# Altium schematic sheet ESP32_T&H_Interface.SchDoc
size A; SheetNumber: 3; SheetTotal: 3
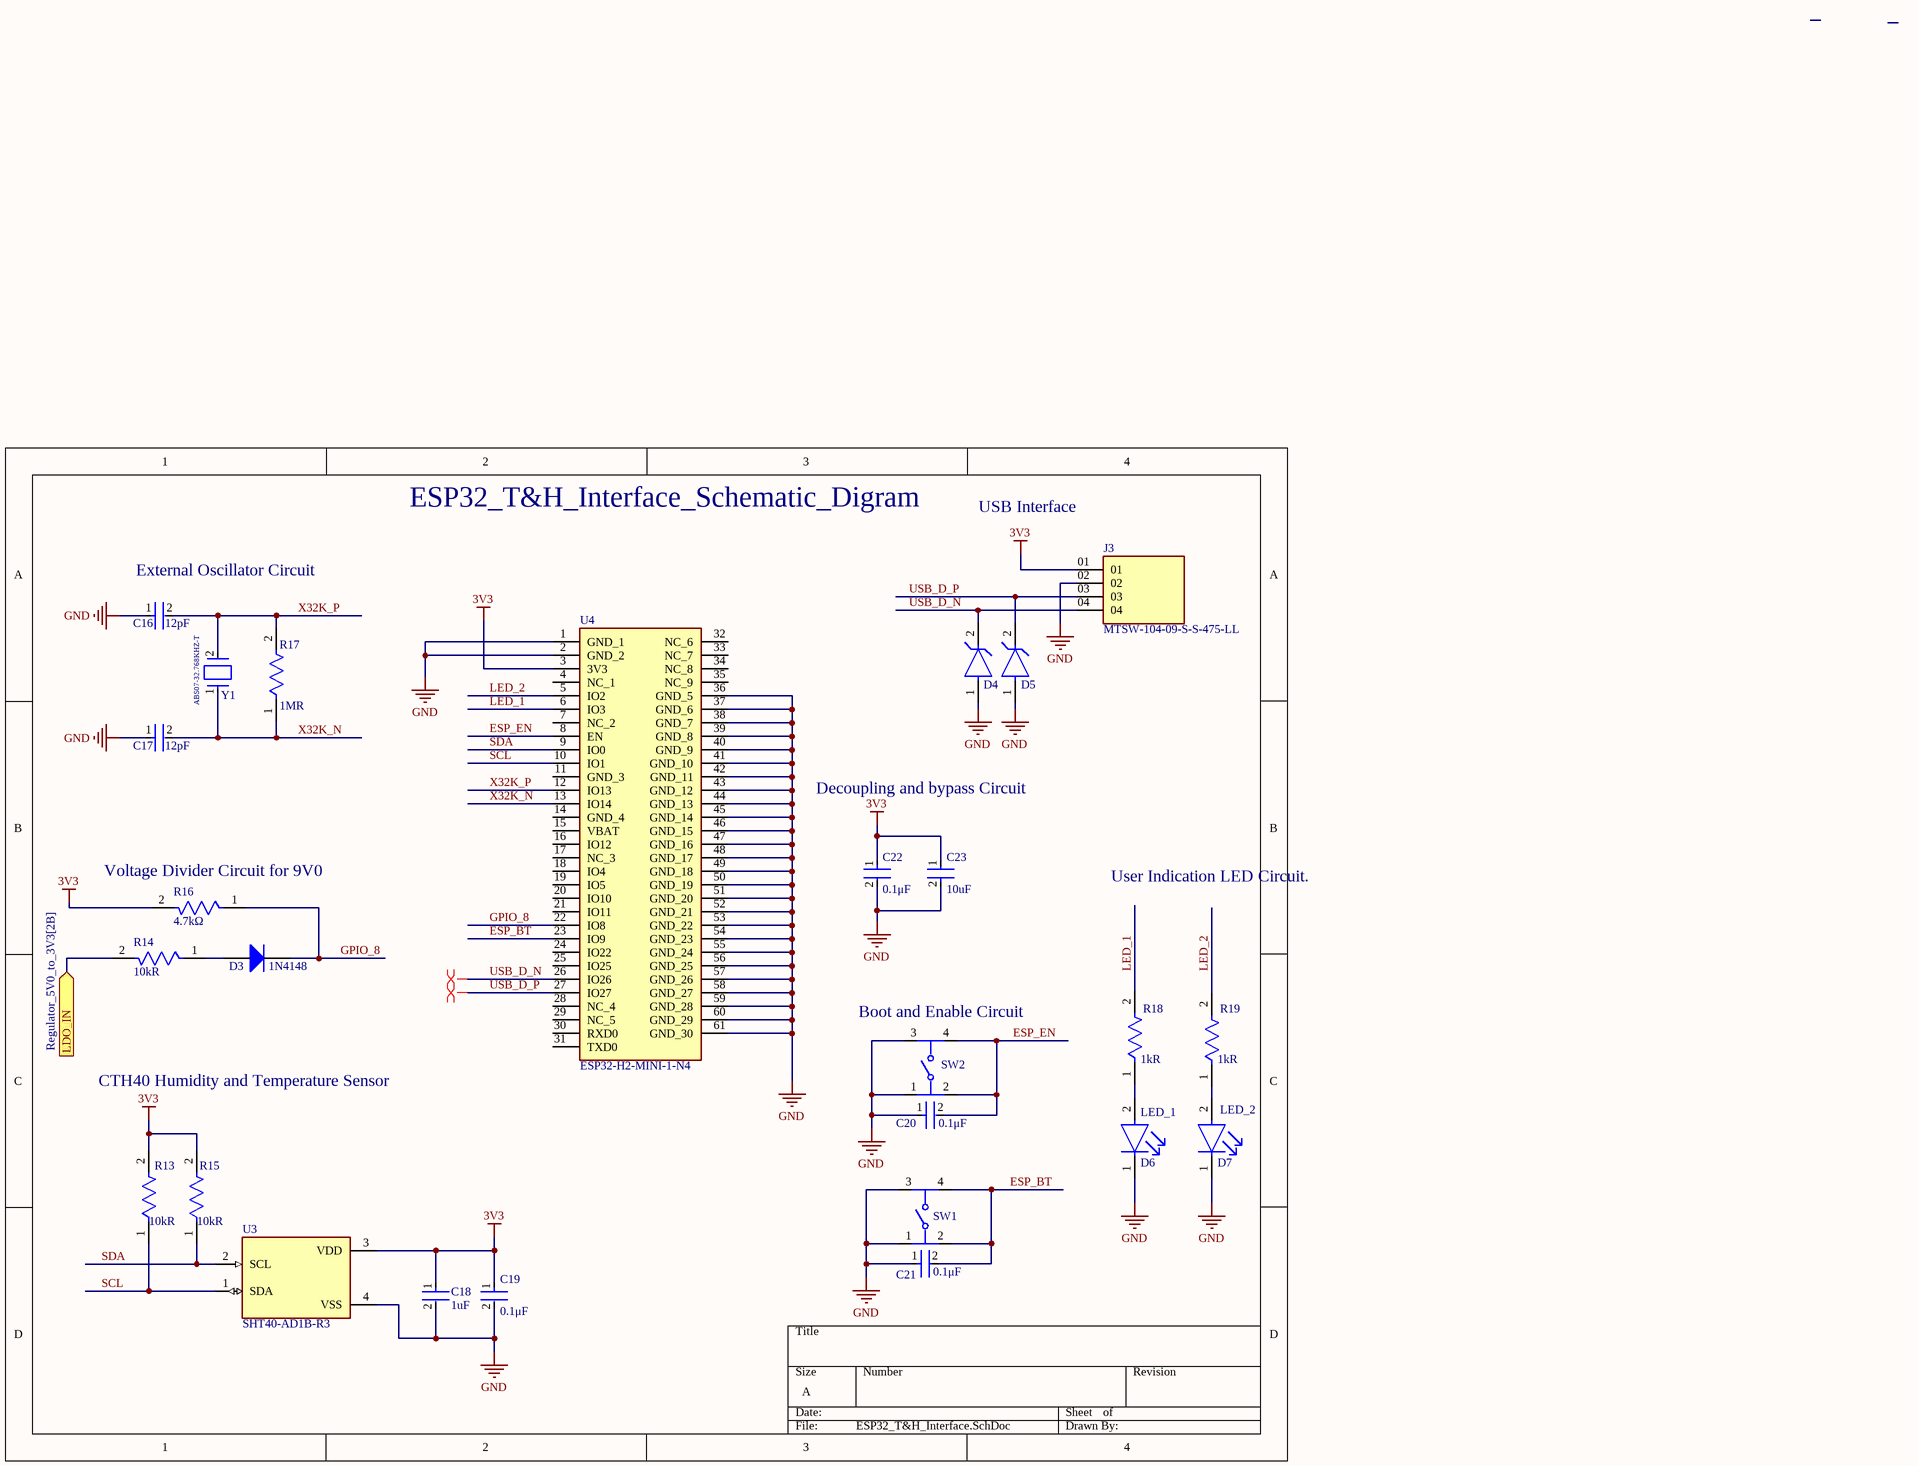
[diagram p0: ESP32_T&H_Interface.SchDoc]

## Parts
C16  Capacitance: 12pF  [FP-0402-L_1_0_1-W_0_5_0_1-IPC_B]  (hidden comment: 04025A120JAT2A)
C17  Capacitance: 12pF  [FP-0402-L_1_0_1-W_0_5_0_1-IPC_B]  (hidden comment: 04025A120JAT2A)
C18  Capacitance: 1uF  [FP-GRM15-0_1-MFG]  (hidden comment: GRM155R61A105KE15D)
C19  Capacitance: 0.1μF  [FP-C0603C-CF-MFG]  (hidden comment: C0603C104K8RACTU)
C20  Capacitance: 0.1μF  [FP-C0603C-CF-MFG]  (hidden comment: C0603C104K8RACTU)
C21  Capacitance: 0.1μF  [FP-C0603C-CF-MFG]  (hidden comment: C0603C104K8RACTU)
C22  Capacitance: 0.1μF  [FP-C0603C-CF-MFG]  (hidden comment: C0603C104K8RACTU)
C23  Capacitance: 10uF  [FP-C1608-080-0_1-IPC_A]  (hidden comment: C1608X5R1A106M080AC)
D3  1N4148  [DIOD-SOD323-2-A_V]
D4  UCLAMP3601P.TNT  [FP-SLP1006P2-MFG]  (value not drawn)
D5  UCLAMP3601P.TNT  [FP-SLP1006P2-MFG]  (value not drawn)
D6  APHHS1005CGCK  [FP-APHHS1005CGCK-MFG]  (value not drawn)
D7  APHHS1005CGCK  [FP-APHHS1005CGCK-MFG]  (value not drawn)
J3  MTSW-104-09-S-S-475-LL  [SAMTEC_MTSW-104-09-S-S-475-LL]
R13  Resistance: 10kR  [FP-AC0402-MFG]  (hidden comment: AC0402FR-0710KL)
R14  Resistance: 10kR  [FP-AC0402-MFG]  (hidden comment: AC0402FR-0710KL)
R15  Resistance: 10kR  [FP-AC0402-MFG]  (hidden comment: AC0402FR-0710KL)
R16  Resistance: 4.7kΩ  [FP-RC0402-0_4-MFG]  (hidden comment: RC0402JR-074K7L)
R17  Resistance: 1MR  [FP-MCR01-IPC_B]  (hidden comment: MCR01MRTF1004)
R18  Resistance: 1kR  [FP-RMCF0402-MFG]  (hidden comment: RMCF0402FT1K00)
R19  Resistance: 1kR  [FP-RMCF0402-MFG]  (hidden comment: RMCF0402FT1K00)
SW1  KMR221NGLFS  [FP-KMR221NGLFS-0]  (value not drawn)
SW2  KMR221NGLFS  [FP-KMR221NGLFS-0]  (value not drawn)
U3  SHT40-AD1B-R3  [SHT4X]
U4  ESP32-H2-MINI-1-N4  [ESP32H2MINI1N4]
Y1  ABS07-32.768KHZ-T  [FP-ABS07-MFG]

## Ports
LDO_IN (in, see Regulator_5V0_to_3V3[2B])

## Nets
3V3: C18.1 C19.1 C22.1 C23.1 J3.01 R13.2 R15.2 R16.2 U3.3(VDD) U4.3(3V3)
GND: C16.1 C17.1 C18.2 C19.2 C20.1 C21.1 C22.2 C23.2 D4.1(A) D5.1(A) D6.1(C) D7.1(C) J3.02 SW1.1 SW1.3 SW2.1 SW2.3 U3.4(VSS) U4.1(GND_1) U4.2(GND_2) U4.36(GND_5) U4.37(GND_6) U4.38(GND_7) U4.39(GND_8) U4.40(GND_9) U4.41(GND_10) U4.42(GND_11) U4.43(GND_12) U4.44(GND_13) U4.45(GND_14) U4.46(GND_15) U4.47(GND_16) U4.48(GND_17) U4.49(GND_18) U4.50(GND_19) U4.51(GND_20) U4.52(GND_21) U4.53(GND_22) U4.54(GND_23) U4.55(GND_24) U4.56(GND_25) U4.57(GND_26) U4.58(GND_27) U4.59(GND_28) U4.60(GND_29) U4.61(GND_30)
ESP_BT: C21.2 SW1.2 SW1.4 U4.23(IO9)
ESP_EN: C20.2 SW2.2 SW2.4 U4.8(EN)
GPIO_8: D3.2(K) R16.1 U4.22(IO8)
LDO_IN: R14.2 ; port LDO_IN
LED_1: R18.2 U4.6(IO3)
LED_2: R19.2 U4.5(IO2)
SCL: R13.1 U3.1(SDA) U4.10(IO1)
SDA: R15.1 U3.2(SCL) U4.9(IO0)
USB_D_N: D4.2(C) J3.04 U4.26(IO26)
USB_D_P: D5.2(C) J3.03 U4.27(IO27)
X32K_N: C17.2 R17.1 U4.13(IO14) Y1.1
X32K_P: C16.2 R17.2 U4.12(IO13) Y1.2
NetD3_1: D3.1(A) R14.1
NetD6_2: D6.2(A) R18.1
NetD7_2: D7.2(A) R19.1

Not connected (* = marked no-connect by the designer): U4 4(NC_1) 7(NC_2) 11(GND_3) 14(GND_4) 15(VBAT) 16(IO12) 17(NC_3) 18(IO4) 19(IO5) 20(IO10) 21(IO11) 24(IO22) 25(IO25) 28(NC_4) 29(NC_5) 30(RXD0) 31(TXD0) 32(NC_6) 33(NC_7) 34(NC_8) 35(NC_9)

## Layout directives
differential pair: USB_D_N, USB_D_P

## Notes on the sheet
- ESP32_T&H_Interface_Schematic_Digram
- USB Interface
- (near C16) External Oscillator Circuit
- Decoupling and bypass Circuit
- (near R16) Voltage Divider Circuit for 9V0
- User Indication LED Circuit.
- (near SW2) Boot and Enable Circuit
- CTH40 Humidity and Temperature Sensor
- (near D6) LED_1
- (near D7) LED_2

## Library data of the parts
C16 C17 = CMP-2008-02574-2: General Purpose Ceramic Capacitor, 0402, 12pF, 5%, C0G, 30ppm/°C, 50V; Insulation Resistance: 100GR; Radiation Hardening: No; RoHS Compliant: Yes; Voltage Rating: 50V; Case Code (Imperial): 0402; Height: 0.5mm; Voltage: 50V; Voltage Rating (DC): 50V; Mount: Surface Mount; Thickness: 0.022inch; Depth: 0.5mm; Max Operating Temperature: 125°C; Construction: Flat; Termination: SMD/SMT; Tolerance: 5%; Length: 1mm; Lead Free: Lead Free; Dielectric: C0G; Number of Pins: 2; Package Quantity: 1; Series: -; Temperature Coefficient: 30ppm/°C; Min Operating Temperature: -55°C; Case/Package: 0402; Packaging: Tape and Reel; Case Code (Metric): 1005; Width: 0.02inch; REACH SVHC: No SVHC
C18 = CMP-2008-04556-2: CAP CER 1UF 10V X5R 0402; Manufacturer: Murata; Material: Ceramic; Tolerance: 10%; Temperature Coefficient: 15%; Octopart: https://octopart.com/grm155r61a105ke15d-murata-197442; Manufacturer Part Number: GRM155R61A105KE15D; Lead Free: Yes; ComponentLink2Description: Datasheet; Temperature: -55°C to +85°C; Temperature Range High: +85°C; Height: 0.55mm; Ipc Land Pattern Name: CAPC10050X50; ComponentLink2URL: https://search.murata.co.jp/Ceramy/image/img/A01X/G101/ENG/GRM155R61A105KE15-01A.pdf; Temperature Range Low: -55°C; Device Class L2: Capacitors; Voltage Rating: 10V; RoHS: TRUE; Device Class L1: Passive Components; Device Class L3: Ceramic Capacitors; Temperature Characteristic: X5R; Mouser Description: 0402 1 uF 10 V ±10% Tolerance X5R Surface Mount Multilayer Ceramic Capacitor; Automotive: No; Package: GRM15-0.1; Digikey Description: CAP CER 1UF 10V X5R 0402; Value: 1uF; Category: Cap
C19-C22 = CMP-1035-02580-3: CAP CER 0.1UF 10V X7R 0603; Manufacturer: KEMET; Tolerance: 0.1; Material: Ceramic; Value: 0.10 μF; Temperature Coefficient: 30ppm/°C; Automotive Grade: Grade 1; Digikey Description: CAP CER 0.1UF 10V X7R 0603; Temperature Range High: +125°C; RoHS: TRUE; ComponentLink2URL: https://api.kemet.com/component-edge/download/datasheet/C0603C100J5GACAUTO.pdf; Lead Free: Yes; Device Class L2: Capacitors; Mouser Description: Multilayer Ceramic Capacitors MLCC - SMD/SMT 10volts 0.1uF X7R 10%; Temperature: -55°C to +125°C; Category: Cap; Height: 0.87mm; Voltage Rating: 10 V; Device Class L3: Ceramic Capacitors; ComponentLink2Description: Datasheet; Automotive: Yes; Manufacturer Part Number: C0603C104K8RACTU; Octopart: https://octopart.com/c0603c104k8ractu-kemet-145075; Temperature Characteristic: X7R; Device Class L1: Passive Components; Temperature Range Low: -55°C; Package: C0603C-CF
C23 = CMP-2000-04980-2: Multilayer Ceramic Capacitors 10μF ±20% 10V X5R SMD 0603; Min Operating Temperature: -55°C; RoHS Compliant: Yes; Package Quantity: 1; Max Operating Temperature: 85°C; Radiation Hardening: No; Packaging: Tape and Reel; REACH SVHC: No SVHC; Length: 1.6mm; Case/Package: 0603; Series: C; Voltage Rating: 10V; Thickness: 0.035inch; Weight: 7.1E-05oz; Dielectric: X5R; Termination: SMD/SMT; Dielectric Material: Ceramic; Mount: Surface Mount; Construction: Flat; Resistor Type: Ceramic; Tolerance: 20%; Case Code (Metric): 1608; Number of Pins: 2; Case Code (Imperial): 0603; Depth: 0.8mm; Lead Free: Lead Free; Width: 0.031inch; Height: 0.8mm; Voltage Rating (DC): 10V
D3 = CMP-1667-00004-1: Fast Switching Diode, 75 V, 0.3 A, -65 to 150 degC, 2-Pin SOD323, RoHS, Tape and Reel; DatasheetVersion: Rev. 25-2, 03/2016; PackageDescription: 2-Pin Small Outline Diode, Body 1.7 x 1.3 mm; ComponentLink2Description: Datasheet; ComponentLink1URL: http://www.diodes.com/; PackageReference: SOD323-2; ComponentLink2URL: http://www.diodes.com/datasheets/ds30097.pdf; ComponentLink1Description: Manufacturer URL
D4 D5 = CMP-56445-000005-1: TVS DIODE 33VWM 60VC SLP1006P2; Direction: Unidirectional; Min Breakdown Voltage: 36V; Leakage Current: 1uA; Peak Pulse Power: 125W; Power Line Protection: No; Number of Unidirectional Channels: 1; Clamping Voltage: 60V; Peak Pulse Current: 2A; Power Dissipation: 170W; Diode Type: ZENER; Element Configuration: Single; Reverse Standoff Voltage: 33V; Max Breakdown Voltage: 45V; Max Operating Temperature: 125°C; Resistor Type: Zener; Series: Automotive, AEC-Q100, uClamp®; Min Operating Temperature: -40°C; Case Code (Imperial): 0402; Number of Pins: 2; Lead Free: Lead Free; Case/Package: SMD/SMT; RoHS Compliant: Yes; Packaging: Tape and Reel; Clamping Voltage-Max: 60V; Depth: 0.6mm; Case Code (Metric): 1006; Length: 1mm; Radiation Hardening: No; Mount: Surface Mount; Working Voltage: 33V
D6 D7 = CMP-44529-000044-1: LED GREEN CLEAR CHIP SMD; Viewing Angle: 120°; Dominant Wavelength: 570nm; Test Current: 20mA; Luminous Intensity: 50mcd; Forward Voltage: 2.1V; Number of LEDs: 1; Lens Color: Clear; Packaging: Tape and Reel; Max Operating Temperature: 85°C; Illumination Color: Green; Length: 1mm; Mount: Surface Mount; Lens Style: Clear; Color: Green; Number of Pins: 2; Wavelength: 570nm; Case/Package: 0402; Width: 0.5mm; Package Quantity: 2000; Case Code (Metric): 1005; Height: 0.6mm; Lead Free: Lead Free; Case Code (Imperial): 0402; Forward Current: 20mA; Min Operating Temperature: -40°C
R13-R15 = CMP-2002-01790-3: RES 10kΩ ±1% 0.063W 0402; Power Rating: 62.5mW; Voltage Rating: 50V; Temperature Coefficient: 100ppm/°C; Max Power Dissipation: 63mW; Tolerance: 1%; Military Standard: Not; Construction: Rectangular; Termination: SMD/SMT; Max Operating Temperature: 155°C; Min Operating Temperature: -55°C; Height: 0.015inch; Lead Free: Lead Free; Width: 0.02inch; Case/Package: 0402; Resistor Type: Thick Film; Series: AC; Features: Moisture Resistant; RoHS Compliant: Yes; Number of Terminations: 2; Case Code (Metric): 1005; Length: 0.039inch; Depth: 0.5mm; Size Code: 0402; Packaging: Tape and Reel; Case Code (Imperial): 0402
R16 = CMP-2002-08011-2: Tolerance: 5%; Power Rating: 63mW; Voltage Rating: 50V; Temperature Coefficient: 100ppm/°C; Composition: Thick Film; Max Operating Temperature: 155°C; Case/Package: 0402; Depth: 500µm; Packaging: Tape & Reel; Number of Pins: 2; Schedule B: 8533210045, 8533210045; Case Code (Imperial): 0402; Termination: SMD/SMT; Military Standard: Not; Lead Free: Lead Free; Width: 500µm; REACH SVHC: No SVHC; Max Power Dissipation: 63mW; Voltage Rating (AC): 50V; Features: Moisture Resistant; Min Operating Temperature: -55°C; Number of Terminations: 2; RoHS: Compliant; Height: 350µm; Voltage Rating (DC): 50V; Length: 1mm
R17 = CMP-08839-019445-1: Thick Film Chip Resistor, 0402, 1MΩ, 1%, 100ppm/°C, 0.063W, 50V; Max Power Dissipation: 63mW; Lead Free: Lead Free; Case Code (Imperial): 0402; Max Operating Temperature: 155°C; Package Quantity: 1; Length: 0.039inch; Temperature Coefficient: 100ppm/°C; Case Code (Metric): 1005; Tolerance: 1%; Case/Package: 0402; RoHS Compliant: Yes; Number of Terminations: 2; Resistor Type: Thick Film; Height: 0.016inch; Packaging: Tape and Reel; Min Operating Temperature: -55°C; Voltage Rating (DC): 50V; Width: 0.02inch; Series: MCR
R18 R19 = CMP-26527-000026-1: 1kΩ ±1% 0.063W 0402 Thick Film Chip Resistor AEC-Q200 compliant; Temperature Coefficient: 100ppm/°C; Power Rating: 63mW; Length: 1mm; RoHS Compliant: Yes; Construction: Rectangular; Height: 0.016inch; Size Code: 0402; Lead Free: Lead Free; Radiation Hardening: No; Tolerance: 1%; Width: 0.02inch; Military Standard: Not; Resistor Type: Thick Film; Number of Terminations: 2; Min Operating Temperature: -55°C; Max Operating Temperature: 155°C; Depth: 0.5mm; Features: Automotive AEC-Q200; Packaging: Tape and Reel; Case Code (Metric): 1005; Mount: Surface Mount; Contact Plating: Tin; Max Power Dissipation: 63mW; Case/Package: 0402; Case Code (Imperial): 0402; Series: RMCF
SW1 SW2 = CMP-10040-000006-1: SWITCH TACTILE SPST-NO 0.05A 32V; Manufacturer: C&K; Contact Current Rating: 50mA; Operating Force: 2N; Contact Resistance: 100mΩ; Electromechanical Life: 200000Cycles; Digikey Description: SWITCH TACTILE SPST-NO 0.05A 32V; Manufacturer Part Number: KMR221NGLFS; Octopart: https://octopart.com/kmr221nglfs-c%26k+components-7203802; Package: 0; Temperature: -40°C to +85°C; Mount: Surface Mount; Device Class L2: Switches; Height: 1.9mm; Device Class L3: Tactile Switches; RoHS: TRUE; Lead Free: Yes; ComponentLink2Description: Datasheet; Device Class L1: Electromechanical; Automotive: No; Mouser Description: Tactile Switches Tact; Category: Switch; Temperature Range High: +85°C; Temperature Range Low: -40°C; Voltage Rating Dc: 32V; ComponentLink2URL: https://dznh3ojzb2azq.cloudfront.net/products/Tactile/KMR2/documents/datasheet.pdf; Throw Configuration: SPST-NO
U3 = SHT40-AD1B-R3: Digital Relative Humidity Temperature Sensor, Â±1.8 / max 3.5 %RH, Â±0.2 Â°C, Ultra-Low-Power, with filtermembrane; MF: Sensirion; SnapEDA_Link: https://www.snapeda.com/parts/SHT40-AD1B-R3/Sensirion/view-part/?ref=snap; Price: None; Purchase-URL: https://pricing.snapeda.com/search/part/SHT40-AD1B-R3/?ref=eda; Check_prices: https://www.snapeda.com/parts/SHT40-AD1B-R3/Sensirion/view-part/?ref=eda; MP: SHT40-AD1B-R3; Availability: In Stock; Value: *; Package: Package
U4 = ESP32-H2-MINI-1-N4: Integrated Circuit; Manufacturer_Name: Espressif Systems; Datasheet Link: https://www.espressif.com/sites/default/files/documentation/esp32-h2-mini-1_mini-1u_datasheet_en.pdf; Height: 2.55mm; Manufacturer_Part_Number: ESP32-H2-MINI-1-N4; Mouser Part Number: 356-ESP32H2MINI1-N4; Mouser Price/Stock: https://www.mouser.co.uk/ProductDetail/Espressif-Systems/ESP32-H2-MINI-1-N4?qs=Jm2GQyTW%2FbiM%252BAVlvjt4eQ%3D%3D
Y1 = CMP-0447-00001-4: Crystal 32.768kHz ±20ppm (Tol) 12.5pF FUND 70kΩ 2-Pin CSMD T/R; ESR (Equivalent Series Resistance): 70kR; Radiation Hardening: No; Frequency: 32.768kHz; Length: 3.2mm; Max Operating Temperature: 85°C; Number of Pins: 2; Series: ABS07; Min Operating Temperature: -40°C; Frequency Tolerance: 20ppm; Packaging: Tape and Reel; Height: 0.9mm; Width: 1.5mm; Depth: 1.5mm; Load Capacitance: 12.5pF; RoHS Compliant: Yes; Tolerance: 20ppm; Termination: SMD/SMT; Lead Free: Lead Free; Series Resistance: 70kR; REACH SVHC: No SVHC; Case/Package: CSMD; Operating Frequency: 32.768 kHz; Package Quantity: 3000
J3 = MTSW-104-09-S-S-475-LL: Package: None; MP: MTSW-104-09-S-S-475-LL; Price: None; Availability: Unavailable; Value: *